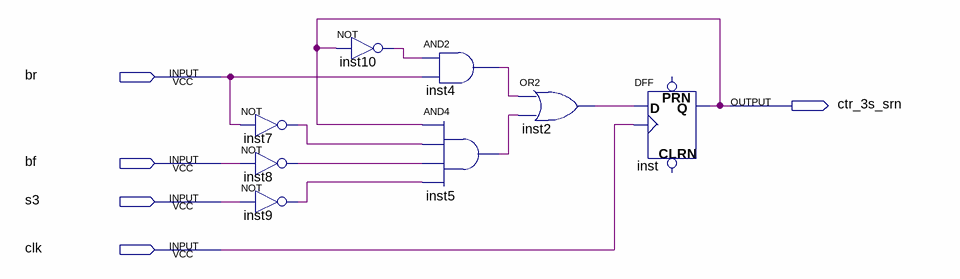
[diagram p0: schematic sheet]
// Quartus schematic is_3s.bdf as structural Verilog: 8 symbols, 5 pins
module is_3s (
  input  br,
  input  bf,
  input  s3,
  input  clk,
  output ctr_3s_srn
);

  wire inst2_out, inst4_out, inst5_out, inst7_out, inst8_out, inst9_out, inst10_out;

  not inst7 (inst7_out, br);
  not inst8 (inst8_out, bf);
  not inst9 (inst9_out, s3);
  not inst10 (inst10_out, ctr_3s_srn);
  and inst4 (inst4_out, inst10_out, br);
  and inst5 (inst5_out, ctr_3s_srn, inst7_out, inst8_out, inst9_out);
  or inst2 (inst2_out, inst4_out, inst5_out);
  DFF inst (.CLK(clk), .D(inst2_out), .Q(ctr_3s_srn));  // open: CLRN, PRN
endmodule
